# EAGLE schematic Esquema (EAGLE 9.6.2)
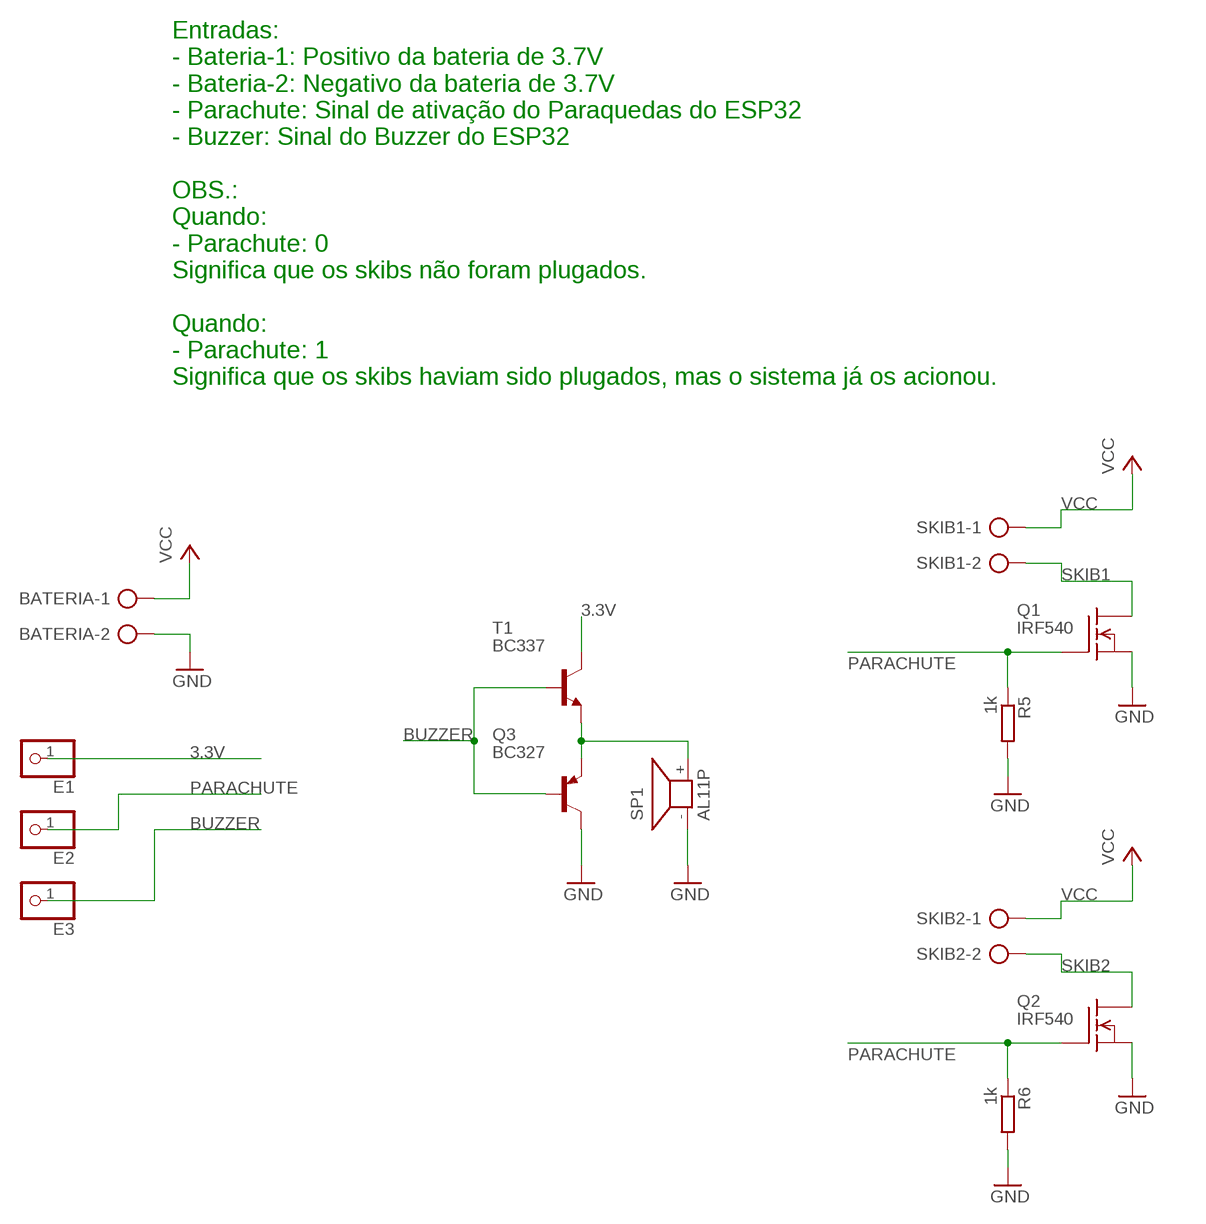
[diagram p0: schematic, sheet 1]

## Parts
BATERIA  AK500/2-H  [AK500/2-H]
E1  PINHD-1X1  [1X01]
E2  PINHD-1X1  [1X01]
E3  PINHD-1X1  [1X01]
Q1  IRF540  [TO220]
Q2  IRF540  [TO220]
Q3  BC327  [TO92]
R5  1k  R-EU_0207/10  [0207/10]
R6  1k  R-EU_0207/10  [0207/10]
SKIB1  AK500/2-H  [AK500/2-H]
SKIB2  AK500/2-H  [AK500/2-H]
SP1  AL11P  [AL11P]
T1  BC337  [TO92]

## Nets
3.3V: E1.1 T1.3(C)
BUZZER: E3.1 Q3.2(B) T1.2(B)
GND: BATERIA.2 Q1.3(S) Q2.3(S) Q3.3(C) R5.2 R6.2 SP1.-
N$1: Q3.1(E) SP1.+ T1.1(E)
PARACHUTE: E2.1 Q1.1(G) Q2.1(G) R5.1 R6.1
SKIB1: Q1.2(D) SKIB1.2
SKIB2: Q2.2(D) SKIB2.2
VCC: BATERIA.1 SKIB1.1 SKIB2.1

## Notes on the sheet
- Entradas:
  - Bateria-1: Positivo da bateria de 3.7V
  - Bateria-2: Negativo da bateria de 3.7V
  - Parachute: Sinal de ativação do Paraquedas do ESP32
  - Buzzer: Sinal do Buzzer do ESP32
  
  OBS.:
  Quando:
  - Parachute: 0
  Significa que os skibs não foram plugados.
  
  Quando:
  - Parachute: 1
  Significa que os skibs haviam sido plugados, mas o sistema já os acionou.

## Library data of the parts
BATERIA SKIB1 SKIB2 = con-ptr500:AK500/2-H: CONNECTOR Aug. 2004 / PTR Meßtechnik: Die Bezeichnung der Serie AK505 wurde geändert. Es handelt sich hierbei um AK500 in horizontaler Ausführung.; OC_FARNELL: unknown; OC_NEWARK: unknown
E1-E3 = pinhead:PINHD-1X1: PIN HEADER
Q1 Q2 = transistor-fet:IRF540: N-Channel Enhancement MOSFET (HEXFET); 100V; 28A; 0,077Ohm
Q3 = transistor-pnp:BC327: PNP Transistor
R5 R6 = rcl:R-EU_: RESISTOR, European symbol; SPICEPREFIX: R
SP1 = buzzer:AL11P: SPEAKER Source: Buerklin; OC_FARNELL: unknown; OC_NEWARK: unknown
T1 = transistor:BC337: NPN TRANSISTOR